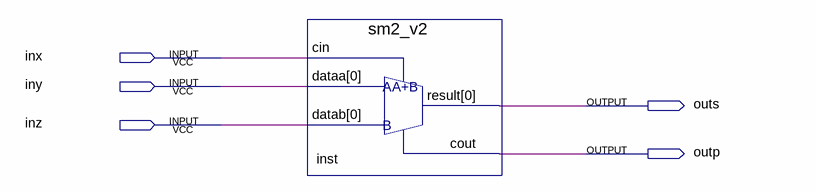
[diagram p0: schematic sheet]
// Quartus schematic sm1_v2.bdf as structural Verilog: 1 symbols, 5 pins
module sm1_v2 (
  input  inx,
  input  iny,
  input  inz,
  output outs,
  output outp
);

  sm2_v2 inst (.cin(inx), .dataa(iny), .datab(inz), .result(outs), .cout(outp));
endmodule
